# Altium schematic sheet gps.SchDoc
size A4
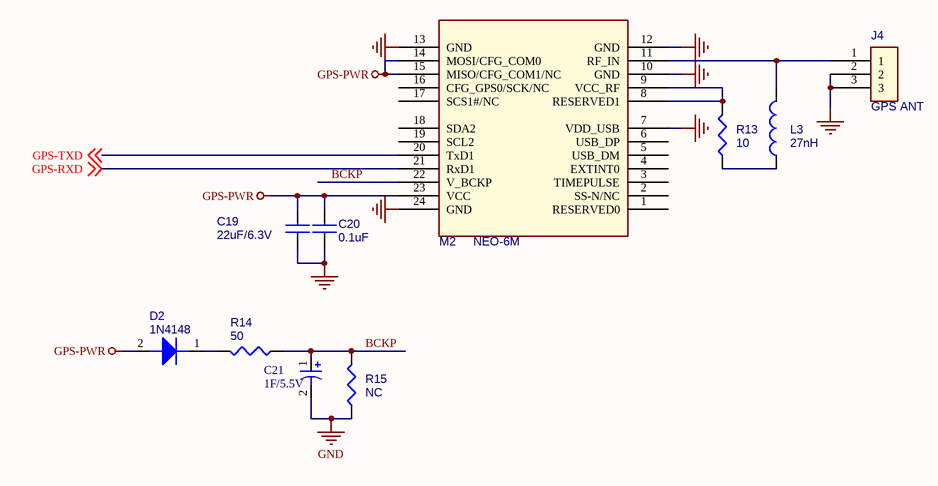
[diagram p0: gps.SchDoc]

## Parts
C19  22uF/6.3V  [0805]
C20  0.1uF  [0603]
C21  1F/5.5V  [SCAP]
D2  1N4148  [MINI-MELF]
J4  GPS ANT  [ANT]
L3  27nH  [0603]
M2  NEO-6M  [NEO-6]
R13  10  [0603]
R14  50  [0603]
R15  NC  [0603]

## Nets
GND: C19.2 C20.2 C21.2 J4.2 J4.3 M2.7(VDD_USB) M2.10(GND) M2.12(GND) M2.13(GND) M2.24(GND) R15.1
GPS-PWR: C19.1 C20.1 D2.2 M2.14(MOSI/CFG_COM0) M2.15(MISO/CFG_COM1/NC) M2.23(VCC)
BCKP: C21.1 M2.22(V_BCKP) R14.1 R15.2
GPS-RXD: M2.21(RxD1) ; off-sheet GPS-RXD
GPS-TXD: M2.20(TxD1) ; off-sheet GPS-TXD
NetD2_1: D2.1 R14.2
NetJ4_1: J4.1 L3.2 M2.11(RF_IN)
NetL3_1: L3.1 R13.1
NetM2_8: M2.8(RESERVED1) M2.9(VCC_RF) R13.2

Not connected (* = marked no-connect by the designer): M2 1(RESERVED0) 2(SS-N/NC) 3(TIMEPULSE) 4(EXTINT0) 5(USB_DM) 6(USB_DP) 16(CFG_GPS0/SCK/NC) 17(SCS1#/NC) 18(SDA2) 19(SCL2)

## Library data of the parts
C19 C20 = P_CAP NP
C21 = Cap Pol1: Polarized Capacitor (Radial)
D2 = 1N4148WS-7-F_SOD323-2
J4 = HRS_U_0.FL-R-SMT-10
L3 = 2.2UH_LPS3015-222MLC_1.5A_20%~D
M2 = NEO-5M
R13-R15 = P_R